# EAGLE design Carloop2-v3.2 (EAGLE 9.1.0)
DATABASE: /home/monkbroc/Electronics/eagle/PARTSDB.tsv
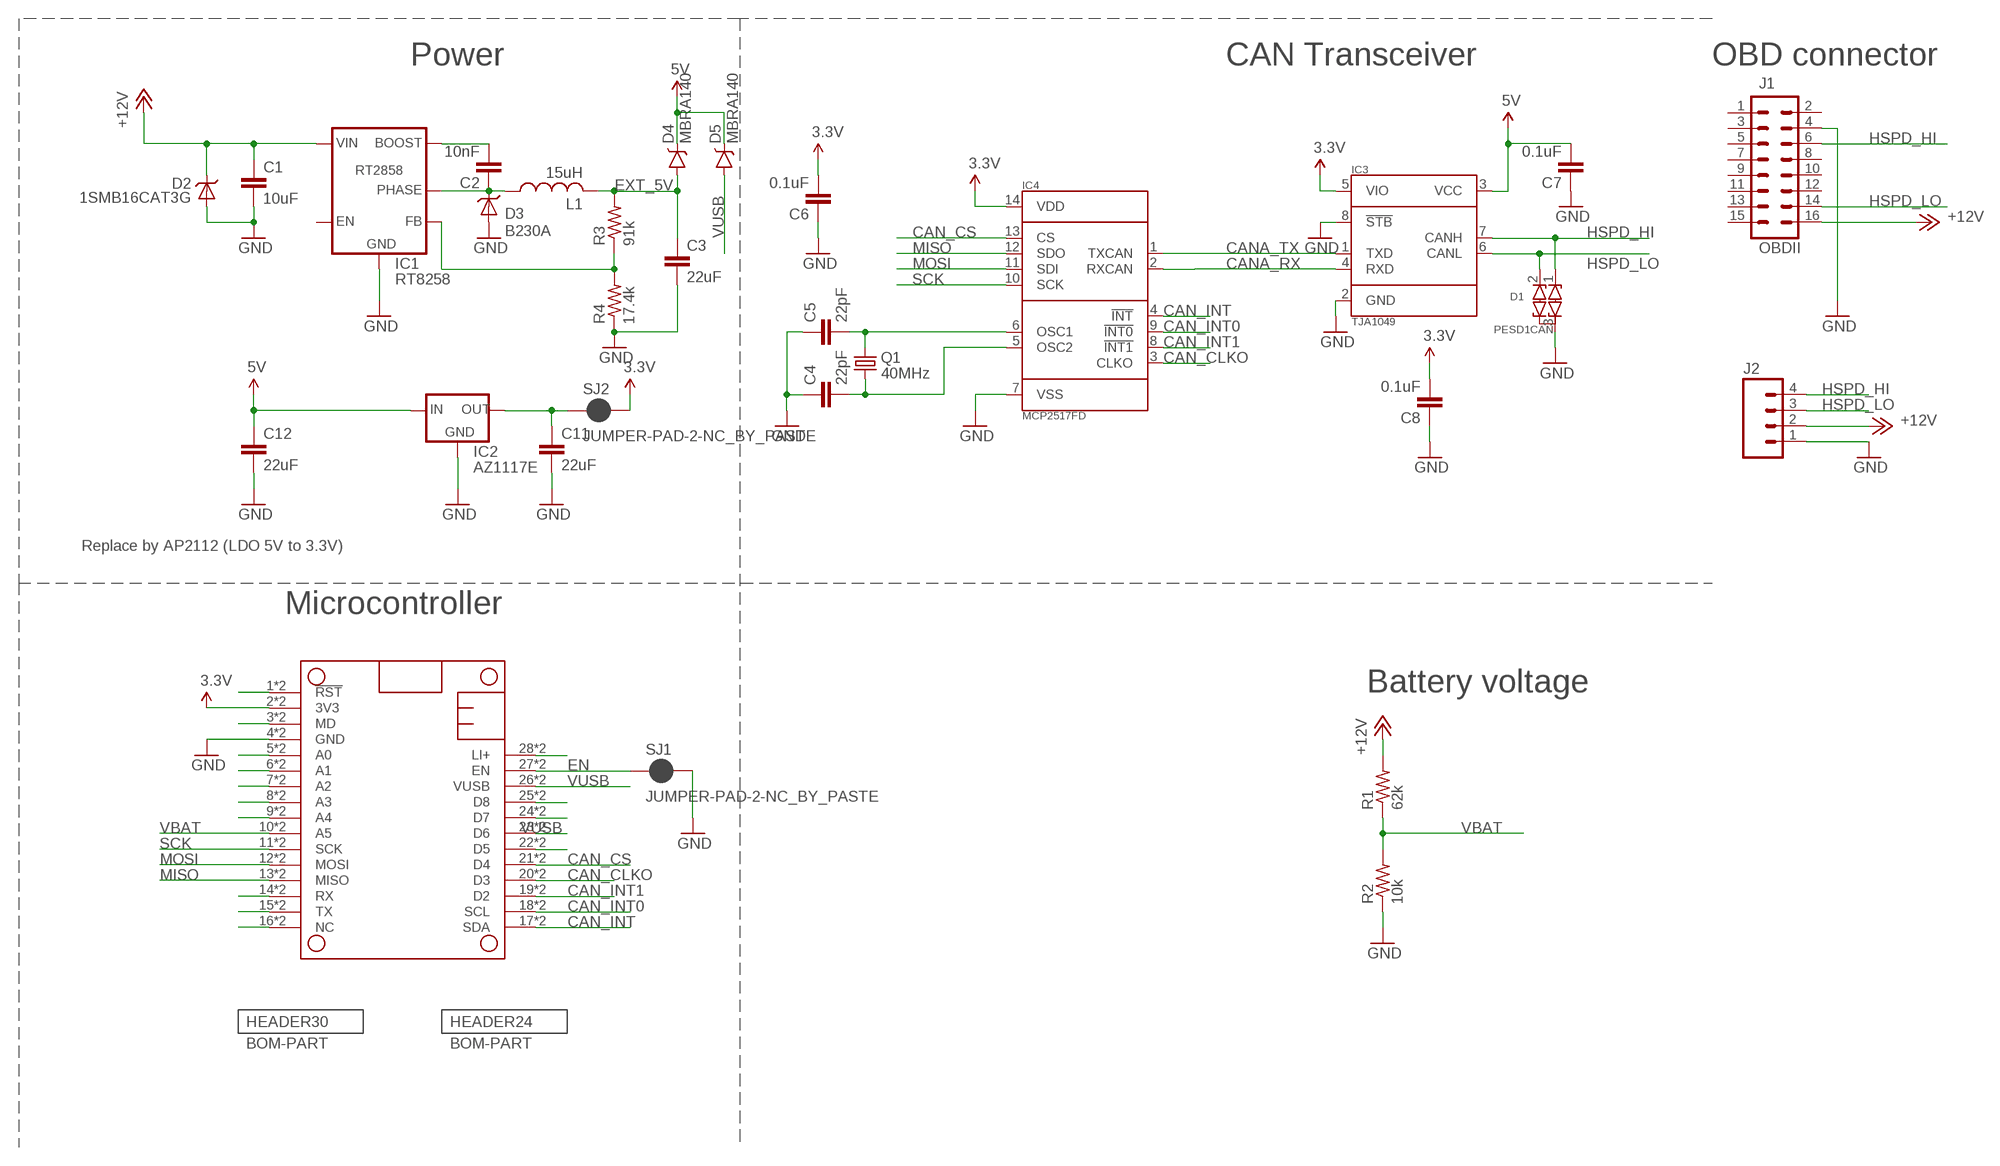
[diagram p0: schematic, sheet 1]
HEADER24 (BOM-PART): BOM: INCLUDE; PARTNO: NPPC122KFMS-RC; QTY: 1
HEADER30 (BOM-PART): BOM: INCLUDE; PARTNO: NPTC152KFMS-RC; QTY: 1

## Parts
C1  10uF  C-EUC1206  [C1206]
C2  10nF  C-EUC0603  [C0603]
C3  22uF  C-EUC1206  [C1206]
C4  22pF  C-EUC0603  [C0603]
C5  22pF  C-EUC0603  [C0603]
C6  0.1uF  C-EUC0603  [C0603]
C7  0.1uF  C-EUC0603  [C0603]
C8  0.1uF  C-EUC0603  [C0603]
C11  22uF  C-EUC1206  [C1206]
C12  22uF  C-EUC1206  [C1206]
D1  PESD1CAN  DIODE_ESD_DUAL-SOT-23  [SOT23]
D2  1SMB16CAT3G  DIODE-TVS-SMB  [SMB-DIODE]
D3  B230A  DIODE-SCHOTTKY  [DO-214AA]
D4  MBRA140  [SMA-DIODE]
D5  MBRA140  [SMA-DIODE]
IC1  RT8258  [SOT-23-6]
IC2  AZ1117E  [SOT223]
IC3  TJA1049  [SO8]
IC4  MCP2517FD  [SOIC-14]
IC5  PARTICLE_MESH_SMTDUAL  [FEATHERWING_SMT2]
J1  OBDII  M08X2-OBDII-COMTECH  [OBDII-COMTECH]
J2  M04SCREW  [SCREWTERMINAL-3.5MM-4]
L1  15uH  L-US  [NR8040]
Q1  40MHz  CRYSTAL5X3  [CRYSTAL-SMD-5X3]
R1  62k  R-US_R0603  [R0603]
R2  10k  R-US_R0603  [R0603]
R3  91k  R-US_R0603  [R0603]
R4  17.4k  R-US_R0603  [R0603]
SJ1  JUMPER-PAD-2-NC_BY_PASTE  [PAD-JUMPER-2-NC_BY_PASTE_YES_SILK]
SJ2  JUMPER-PAD-2-NC_BY_PASTE  [PAD-JUMPER-2-NC_BY_PASTE_YES_SILK]

## Nets
3.3V: C6.2 C8.2 IC3.5(VIO) IC4.14(VDD) IC5.2'(3V3) IC5.2(3V3) SJ2.2
5V: C7.2 C12.1 D4.C D5.C IC2.3(IN) IC3.3(VCC)
+12V [power]: C1.1 D2.C IC1.5(VIN) J1.16 J2.2 R1.2
BOOST\: C2.2 IC1.1(BOOST)
CAN_CLKO: IC4.3(CLKO) IC5.20'(D3) IC5.20(D3)
CAN_CS: IC4.13(CS) IC5.21'(D4) IC5.21(D4)
CAN_INT: IC4.4(!INT) IC5.17'(SDA) IC5.17(SDA)
CAN_INT0: IC4.9(!INT0) IC5.18'(SCL) IC5.18(SCL)
CAN_INT1: IC4.8(!INT1) IC5.19'(D2) IC5.19(D2)
CANA_RX: IC3.4(RXD) IC4.2(RXCAN)
CANA_TX: IC3.1(TXD) IC4.1(TXCAN)
EN: IC5.27'(EN) IC5.27(EN) SJ1.1
EXT_5V: C3.1 D4.A L1.P$2 R3.2
FB: IC1.3(FB) R3.1 R4.2
GND [power]: C1.2 C3.2 C4.1 C5.1 C6.1 C7.1 C8.1 C11.2 C12.2 D1.3(COM) D2.A D3.+(A) IC1.2(GND) IC2.1(GND) IC2.4(GND) IC3.2(GND) IC3.8(!STB) IC4.7(VSS) IC5.4'(GND) IC5.4(GND) J1.4 J2.1 R2.1 R4.1 SJ1.2
HSPD_HI: D1.1(C1) IC3.7(CANH) J1.6 J2.4
HSPD_LO: D1.2(C2) IC3.6(CANL) J1.14 J2.3
LI+: IC5.28'(LI+) IC5.28(LI+)
MISO: IC4.12(SDO) IC5.13'(MISO) IC5.13(MISO)
MOSI: IC4.11(SDI) IC5.12'(MOSI) IC5.12(MOSI)
N$1: C11.1 IC2.2(OUT) SJ2.1
N$2: C5.2 IC4.6(OSC1) Q1.3
N$3: IC5.1'(!RST) IC5.1(!RST)
N$4: IC5.3'(MD) IC5.3(MD)
N$5: IC5.5'(A0) IC5.5(A0)
N$6: IC5.6'(A1) IC5.6(A1)
N$7: IC5.7'(A2) IC5.7(A2)
N$8: IC5.8'(A3) IC5.8(A3)
N$9: IC5.9'(A4) IC5.9(A4)
N$10: IC5.25'(D8) IC5.25(D8)
N$11: IC5.24'(D7) IC5.24(D7)
N$12: IC5.23'(D6) IC5.23(D6)
N$13: IC5.22'(D5) IC5.22(D5)
N$14: IC5.14'(RX) IC5.14(RX)
N$15: IC5.15'(TX) IC5.15(TX)
N$16: IC5.16'(NC) IC5.16(NC)
N$18: C4.2 IC4.5(OSC2) Q1.1
PHASE: C2.1 D3.-(C) IC1.6(PHASE) L1.P$1
SCK: IC4.10(SCK) IC5.11'(SCK) IC5.11(SCK)
VBAT: IC5.10'(A5) IC5.10(A5) R1.1 R2.2
VUSB: D5.A IC5.26'(VUSB) IC5.26(VUSB)
Unconnected: IC1.4(EN) J1.1 J1.2 J1.3 J1.5 J1.7 J1.8 J1.9 J1.10 J1.11 J1.12 J1.13 J1.15

## Notes on the sheet
- Power | CAN Transceiver | OBD connector
- Replace by AP2112 (LDO 5V to 3.3V)
- Microcontroller
- Battery voltage

## Library data of the parts
C1 = rcl:C-EU: CAPACITOR, European symbol; PARTNO: C3216X7R1E106K160AB; SPICEPREFIX: C
C2 = rcl:C-EU: CAPACITOR, European symbol; PARTNO: CGA3E2X8R1H103K080AA; SPICEPREFIX: C
C3 C11 C12 = rcl:C-EU: CAPACITOR, European symbol; PARTNO: CL31X226KAHN3NE; SPICEPREFIX: C
C4 C5 = rcl:C-EU: CAPACITOR, European symbol; PARTNO: CC0603KRX7R9BB223; SPICEPREFIX: C
C6-C8 = rcl:C-EU: CAPACITOR, European symbol; PARTNO: CC0603JRX7R7BB104; SPICEPREFIX: C
D1 = MuniRent:DIODE_ESD_DUAL: Dual ESD Diode, with a common anode; PARTNO: PESD1CAN-215
D2 = BUG:DIODE-TVS; PARTNO: 1SMB16CAT3G; ROLE: Overvoltage protection
D3 = MuniRent:DIODE-SCHOTTKY; PARTNO: B230A-13-F
D4 D5 = SparkFun-DiscreteSemi:MBRA140: 40V, 1A Schottky rectifier SMA/DO-214AC package DIO-08053; PARTNO: MBRA140T3G; PROD_ID: DIO-08053
IC1 = MuniRent:RT8258; PARTNO: RT8258GJ6
IC2 = Carloop:AZ1117E: AZ1117E (https://www.diodes.com/assets/Datasheets/AZ1117E.pdf) - 1.3A output LDO Regulator; PARTNO: AZ1117EH-3.3TRG1
IC3 = MuniRent:TJA1049; PARTNO: TJA1049T-118
IC4 = Carloop:MCP2517FD; PARTNO: MCP2517FD-H/SL
IC5 = Particle-Mesh:PARTICLE_MESH; BOM: EXCLUDE
J1 = MuniRent:M08X2: .1" headers, two rows of 8 each; PARTNO: OBD-II
J2 = SparkFun-Connectors:M04: Header 4 Standard 4-pin 0.1" header. Use with straight break away headers (SKU : PRT-00116), right angle break away headers (PRT-00553), swiss pins (PRT-00743), machine pins (PRT-00117), and female headers (PRT-00115). Molex polarized connector foot print use with SKU : PRT-08231 with associated crimp pins and housings. 1MM SMD Version SKU: PRT-10208; PARTNO: OSTTE040104
L1 = MuniRent:L-US; PARTNO: NR8040T150M
Q1 = SparkFun-FreqCtrl:CRYSTAL: Various standard crystals. Proven footprints.; PARTNO: ECS-400-12-30B-AGM-TR; PROD_ID: XTAL-08218
R1 = rcl:R-US_: RESISTOR, American symbol; PARTNO: ERA-3AEB623V; SPICEPREFIX: R
R2 = rcl:R-US_: RESISTOR, American symbol; PARTNO: ERA-3AED103V; SPICEPREFIX: R
R3 = rcl:R-US_: RESISTOR, American symbol; PARTNO: ERA-3ARB913V; SPICEPREFIX: R
R4 = rcl:R-US_: RESISTOR, American symbol; PARTNO: ERJ-3EKF1742V; SPICEPREFIX: R
SJ1 SJ2 = SparkFun-Passives:JUMPER-PAD-2-NC_BY_PASTE; BOM: EXCLUDE

## Net classes
0 default: width 0.254 mm
1 power: width 0.508 mm, clearance 0.254 mm
2 thickpower: width 0.406 mm

## Board
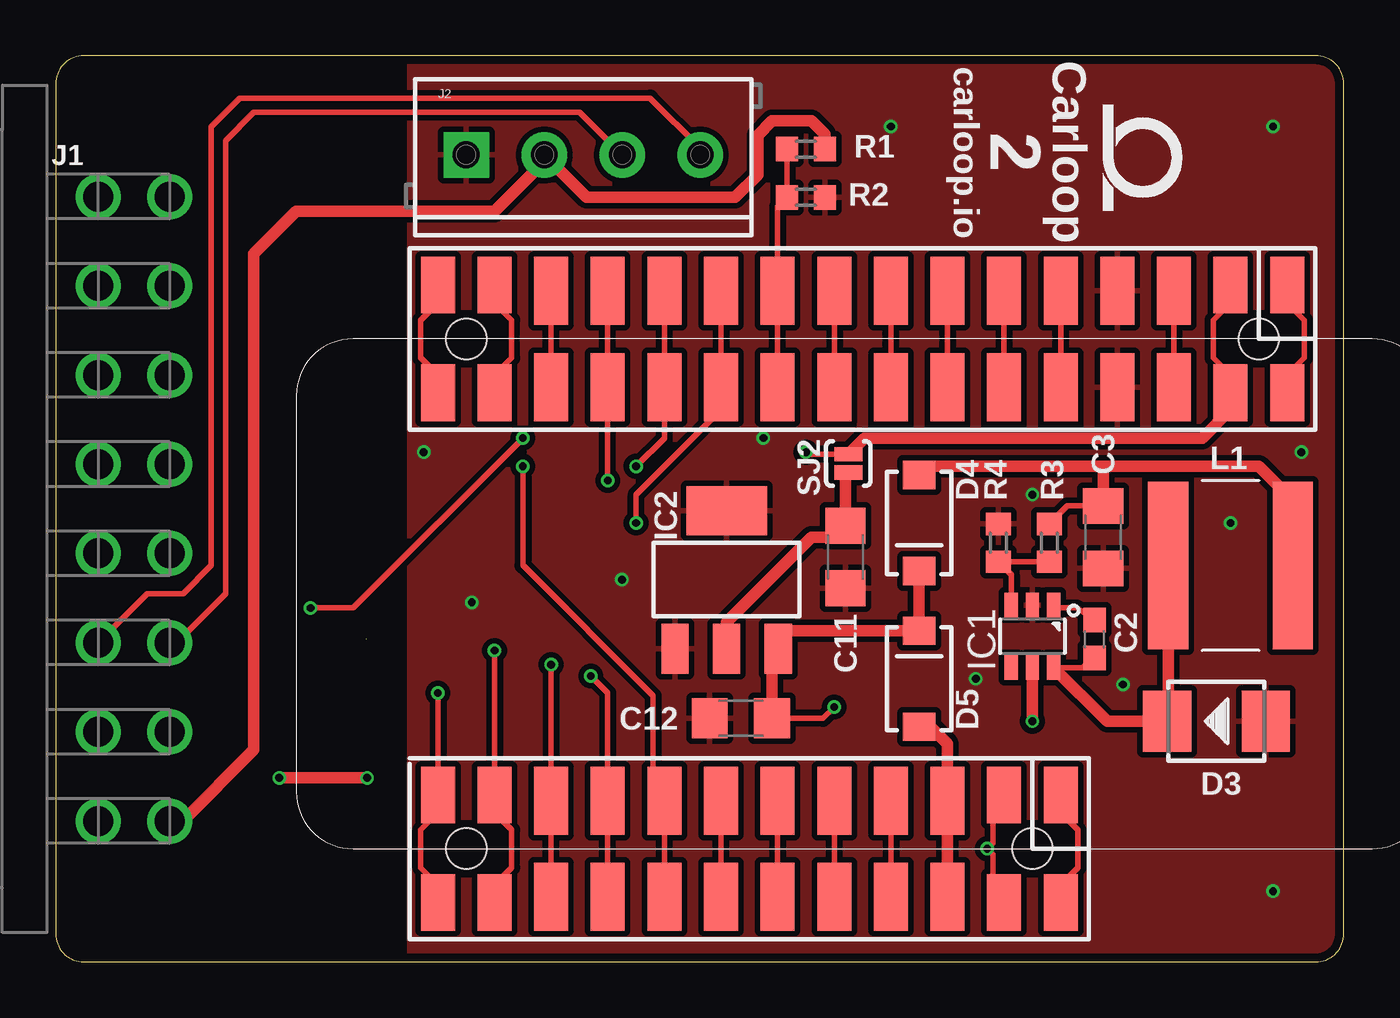
[diagram p1: board, top side]
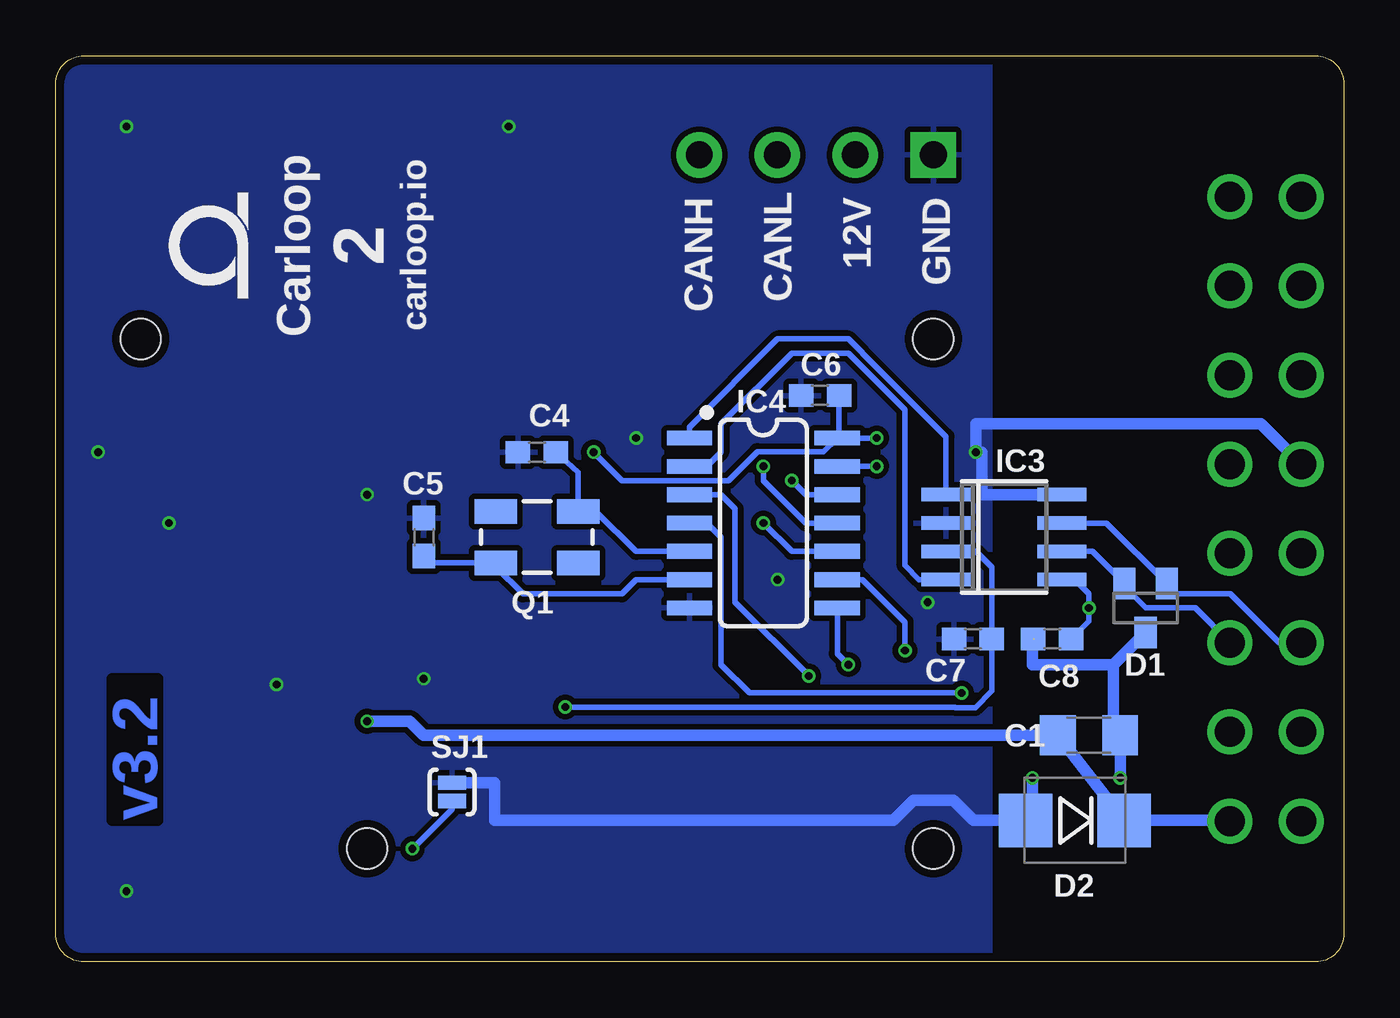
[diagram p2: board, bottom side, seen from below]

Size 57.79 x 40.64 mm. Coordinates in mm from the lower left corner, seen from the top.
Outline: 0,39.37 0,1.27 arc90 1.27,0 56.52,0 arc90 57.79,1.27 57.79,39.37 arc90 56.52,40.64 1.27,40.64 arc90 0,39.37
Copper layers (1*16): Top 0.035559375mm / dielectric 1.6mm / Bottom 0.035559375mm
Design rules "oshpark-2layer": minimum track width 6mil, minimum drill 10mil, track to track 6mil, track to pad 6mil, pad to pad 6mil, via to via 6mil, smd to smd 6mil, copper to edge 15mil, drill to drill 6mil, minimum pad ring 5mil, minimum via ring 5mil, stop-mask expansion 2.5mil, vias tented up to drill 0mil, thermal gap 10mil

### Footprints (pad centres in the part's own frame; a part is rotated, then mirrored left to right if it is on the bottom)
C1206 = smd 1.6 x 1.8: 1 -1.4,0; 2 1.4,0
C0603 = smd 1.1 x 1: 1 -0.85,0; 2 0.85,0
SOT23 = smd 1 x 1.4: 1 -0.95,-1.1; 2 0.95,-1.1; 3 0,1.1
SMB-DIODE = smd 2.4 x 2.4: A 2.2,0; C -2.2,0
DO-214AA = smd 2.159 x 2.743: + -2.21,0; - 2.21,0
SMA-DIODE = smd 1.27 x 1.47: A -2.15,0; C 2.15,0
SOT-23-6 = smd 1.1 x 0.6: 1 -1.4,0.95; 2 -1.4,0; 3 -1.4,-0.95; 4 1.4,-0.95; 5 1.4,0; 6 1.4,0.95
SOT223 = smd 1.219 x 2.235: 1 -2.311,-3.099; 2 0,-3.099; 3 2.311,-3.099 | smd 3.6 x 2.2: 4 0,3.099
SO8 = smd 0.6 x 2.2: 1 -1.905,-2.6; 2 -0.635,-2.6; 3 0.635,-2.6; 4 1.905,-2.6; 5 1.905,2.6; 6 0.635,2.6; 7 -0.635,2.6; 8 -1.905,2.6
SOIC-14 = smd 0.66 x 2.032: 1 -4.445,-3.315; 2 -3.175,-3.315; 3 -1.905,-3.315; 4 -0.635,-3.315; 5 0.635,-3.315; 6 1.905,-3.315; 7 3.175,-3.315; 8 3.175,3.315; 9 1.905,3.315; 10 0.635,3.315; 11 -0.635,3.315; 12 -1.905,3.315; 13 -3.175,3.315; 14 -4.445,3.315
FEATHERWING_SMT2 = smd 1.524 x 2.54: 1 6.35,2.413; 1' 6.35,-2.413; 2 8.89,2.413; 2' 8.89,-2.413; 15 41.91,2.413; 15' 41.91,-2.413; 16 44.45,2.413; 16' 44.45,-2.413; 17 44.45,20.447; 17' 44.45,25.273; 18 41.91,20.447; 18' 41.91,25.273; 27 19.05,20.447; 27' 19.05,25.273; 28 16.51,20.447; 28' 16.51,25.273 | smd 1.524 x 3.048: 3 11.43,2.159; 3' 11.43,-2.159; 4 13.97,2.159; 4' 13.97,-2.159; 5 16.51,2.159; 5' 16.51,-2.159; 6 19.05,2.159; 6' 19.05,-2.159; 7 21.59,2.159; 7' 21.59,-2.159; 8 24.13,2.159; 8' 24.13,-2.159; 9 26.67,2.159; 9' 26.67,-2.159; 10 29.21,2.159; 10' 29.21,-2.159; 11 31.75,2.159; 11' 31.75,-2.159; 12 34.29,2.159; 12' 34.29,-2.159; 13 36.83,2.159; 13' 36.83,-2.159; 14 39.37,2.159; 14' 39.37,-2.159; 19 39.37,20.701; 19' 39.37,25.019; 20 36.83,20.701; 20' 36.83,25.019; 21 34.29,20.701; 21' 34.29,25.019; 22 31.75,20.701; 22' 31.75,25.019; 23 29.21,20.701; 23' 29.21,25.019; 24 26.67,20.701; 24' 26.67,25.019; 25 24.13,20.701; 25' 24.13,25.019; 26 21.59,20.701; 26' 21.59,25.019 | hole 1.8: 17.78,22.86; 43.18,22.86; 7.62,0; 43.18,0
OBDII-COMTECH = drill 1.346: 1 -14,0; 2 -10,0; 3 -6,0; 4 -2,0; 5 2,0; 6 6,0; 7 10,0; 8 14,0; 9 -14,3.2; 10 -10,3.2; 11 -6,3.2; 12 -2,3.2; 13 2,3.2; 14 6,3.2; 15 10,3.2; 16 14,3.2
SCREWTERMINAL-3.5MM-4 = drill 1.2 pad 2.032 square: 1 0,0 | drill 1.2 pad 2.032: 2 3.5,0; 3 7,0; 4 10.5,0
NR8040 = smd 1.8 x 7.5: P$1 2.8,0; P$2 -2.8,0
CRYSTAL-SMD-5X3 = smd 1.9 x 1.1: 1 -1.85,-1.15; 2 1.85,-1.15; 3 1.85,1.15; 4 -1.85,1.15
R0603 = smd 1 x 1.1: 1 -0.85,0; 2 0.85,0
PAD-JUMPER-2-NC_BY_PASTE_YES_SILK = smd 0.635 x 1.27: 1 -0.401,0; 2 0.413,0

### Placement (x,y rotation side)
C1  11.43,10.16 0 bottom
C2  46.61,14.48 90 top
C3  46.99,19.05 270 top
C4  36.2,22.86 0 bottom
C5  41.27,19.05 270 bottom
C6  23.49,25.4 0 bottom
C7  16.64,14.48 0 bottom
C8  13.08,14.48 0 bottom
C11  35.43,18.16 270 top
C12  30.73,10.92 180 top
D1  8.89,15.88 180 bottom
D2  12.06,6.35 180 bottom
D3  52.07,10.8 180 top
D4  38.73,19.69 270 top
D5  38.73,12.7 90 top
IC1  43.82,14.61 270 top
IC2  30.1,17.14 0 top
IC3  15.24,19.05 270 bottom
IC4  26.04,19.05 270 bottom
IC5  61.59,27.94 180 top
J1  1.91,20.32 270 top
J2  18.41,36.2 0 top
L1  52.71,17.78 180 top
Q1  36.2,19.05 180 bottom
R1  33.66,36.45 0 top
R2  33.66,34.29 180 top
R3  44.58,18.8 90 top
R4  42.29,18.8 270 top
SJ1  40.01,7.62 90 bottom
SJ2  35.56,22.35 90 top
U$3  LOGOSMALL  [CARLOOP-2]  48.77,36.07 270 top
U$5  LOGOSMALL  [CARLOOP-2]  50.93,32.13 90 bottom

### Tracks (layer width: path | path; a pad name or v marks a point on that pad's centre or on a via)
3.3V  (via drill 0.35)
  Top 0.254: IC5.2 52.71,26.32 51.93,27.09 51.93,28.79 52.71,29.56 IC5.2' | SJ2.2 33.75,22.77 v33.66,22.86 | v20.95,23.5 13.34,15.88 v11.43,15.88
  Top 0.508: IC5.2 52.71,24.77 51.44,23.5 36.29,23.5 SJ2.2
  Bottom 0.254: IC3.5 12.69,17.1 12.02,17.1 11.43,16.51 v11.43,15.88 11.43,15.28 C8.2 | C6.2 22.64,23.57 IC4.14 | IC4.14 23.33,22.88 26.31,22.88 27.6,21.59 32.39,21.59 v33.66,22.86 | IC4.14 v20.95,23.5
5V  (via drill 0.35)
  Top 0.254: C12.1 34.42,10.92 v34.93,11.43
  Top 0.508: D4.C D5.C 32.41,14.85 IC2.3 32.13,13.77 C12.1
  Bottom 0.254: IC3.3 16.51,18.41 15.79,17.69 C7.2 15.79,12.15 16.53,11.41 17.42,11.41 17.44,11.43 v34.93,11.43
+12V  (via drill 0.35)
  Top 0.508: IC1.5 v43.82,10.8 | J1.16 5.69,6.32 8.89,9.52 8.89,31.75 10.79,33.66 19.68,33.66 21.91,35.88 J2.2 23.82,34.29 30.48,34.29 31.5,35.31 31.5,37.08 32.13,37.72 33.91,37.72 34.51,37.12 R1.2
  Bottom 0.508: J1.16 arc-45 5.18,6.35 D2.C C1.1 41.27,10.16 41.91,10.8 v43.82,10.8
  Bottom 0.813: J1.16 arc-45 5.18,6.35
BOOST\
  Top 0.254: IC1.1 44.9,15.88 45.8,15.88 C2.2
CAN_CLKO  (via drill 0.35)
  Top 0.254: IC5.20' 24.76,6.99 | 24.76,6.99 IC5.20 | 24.76,6.99 24.76,12.07 v24,12.83
  Bottom 0.254: IC4.3 27.94,20.96 27.3,20.32 27.3,16.13 v24,12.83
CAN_CS  (via drill 0.35)
  Top 0.254: IC5.21' IC5.21 26.8,7.75 26.8,11.94 20.95,17.78 v20.95,22.23
  Bottom 0.254: IC4.13 v20.95,22.23
CAN_INT  (via drill 0.35)
  Top 0.254: IC5.17' 17.14,3.46 16.37,4.23 16.37,5.93 17.14,6.7 17.14,6.99 | 17.14,6.99 IC5.17 | v17.14,12.07 17.14,6.99
  Bottom 0.254: IC4.4 28.57,19.69 27.94,19.05 27.94,13.34 26.67,12.07 v17.14,12.07
CAN_INT0  (via drill 0.35)
  Top 0.254: IC5.18' 19.68,3.46 20.46,4.23 20.46,5.93 19.68,6.7 IC5.18 v19.68,13.97
  Bottom 0.254: IC4.9 21.59,17.14 19.68,15.24 v19.68,13.97
CAN_INT1  (via drill 0.35)
  Top 0.254: IC5.19' IC5.19 v22.22,13.34
  Bottom 0.254: IC4.8 22.72,13.83 v22.22,13.34
CANA_RX
  Bottom 0.254: IC4.2 28.57,22.23 27.94,22.86 27.94,24.13 24.76,27.3 22.22,27.3 19.68,24.77 19.68,17.78 19.05,17.14 IC3.4
CANA_TX
  Bottom 0.254: IC3.1 17.84,23.55 20.95,26.67 | 20.95,26.67 | 20.95,26.67 22.22,27.94 25.4,27.94 29.35,23.99 IC4.1
EN  (via drill 0.35)
  Top 0.254: 42.29,2.67 IC5.27' 42.04,3.17 42.04,4.83 v41.78,5.08 42.04,5.33 42.04,6.99 IC5.27
  Bottom 0.254: v41.78,5.08 40.01,6.86 SJ1.1
EXT_5V
  Top 0.254: R3.2 45.38,20.45 C3.1
  Top 0.508: L1.P$2 55.25,18.04 55.25,20.96 53.98,22.23 46.99,22.23 | 46.99,22.23 38.73,22.23 D4.A | C3.1 46.99,22.23
FB
  Top 0.254: R3.1 R4.2 42.87,17.37 IC1.3
GND  (via drill 0.35)  (1 unrouted)
  Top 0.508: v13.97,8.25 v10.03,8.25
  Bottom 0.508: J1.4 3.71,24.13 16.51,24.13 v16.51,22.86 16.23,22.86 16.23,20.96 IC3.8 | D1.3 10.33,13.34 | C8.1 13.97,14.49 13.97,13.34 10.33,13.34 | v13.97,8.25 13.97,6.65 D2.A 16.62,6.35 17.52,7.25 19.31,7.25 20.21,6.35 38.1,6.35 38.1,8.03 SJ1.2 | v10.03,8.25 C1.2 10.33,10.16 10.33,13.34
  other vias: 37.47,37.47 54.61,37.47 52.71,19.69 55.88,22.86 41.27,12.7 25.4,17.14 18.67,16.13 31.75,23.5 43.82,20.96 47.88,12.45 54.61,3.17
  pour Bottom: 15.88,40.64 15.88,0 57.79,0 57.79,40.64
  pour Top: 15.88,40.64 15.88,0 57.79,0 57.79,40.64
HSPD_HI
  Top 0.254: J1.6 4.1,16.51 5.71,16.51 6.99,17.78 6.99,37.47 8.26,38.73 26.67,38.73 28.91,36.49 J2.4
  Bottom 0.254: J1.6 2.89,14.32 5.08,16.51 7.62,16.51 7.94,16.83 D1.1 10.65,19.69 IC3.7
HSPD_LO
  Top 0.254: J2.3 23.51,38.1 8.89,38.1 7.62,36.83 7.62,16.51 5.43,14.32 J1.14
  Bottom 0.254: J1.14 6.66,15.88 8.89,15.88 9.84,16.82 D1.2 11.28,18.41 IC3.6
LI+
  Top 0.254: IC5.28 45.09,6.7 45.86,5.93 45.86,4.23 45.09,3.46 IC5.28'
MISO  (via drill 0.35)
  Top 0.254: v24.76,21.59 IC5.13 IC5.13'
  Bottom 0.254: IC4.12 24.13,20.96 v24.76,21.59
MOSI  (via drill 0.35)
  Top 0.254: v26.04,22.23 27.3,23.5 IC5.12 IC5.12'
  Bottom 0.254: IC4.11 24.13,19.69 26.04,21.59 v26.04,22.23
N$1
  Top 0.508: IC2.2 30.1,15.24 33.91,19.05 34.92,19.05 C11.1 35.43,21.82 SJ2.1
N$2
  Bottom 0.254: IC4.6 31.75,17.14 32.39,16.51 36.83,16.51 38.05,17.73 Q1.3 41.08,17.9 C5.2
N$3
  Top 0.254: IC5.1' 55.25,29.56 56.02,28.79 56.02,27.09 55.25,26.32 IC5.1
N$4
  Top 0.254: IC5.3' IC5.3
N$5
  Top 0.254: IC5.5 IC5.5'
N$6
  Top 0.254: IC5.6' IC5.6
N$7
  Top 0.254: IC5.7' IC5.7
N$8
  Top 0.254: IC5.8 IC5.8'
N$9
  Top 0.254: IC5.9' IC5.9
N$10
  Top 0.254: IC5.25 IC5.25'
N$11
  Top 0.254: IC5.24' IC5.24
N$12
  Top 0.254: IC5.23 IC5.23'
N$13
  Top 0.254: IC5.22' IC5.22
N$14
  Top 0.254: IC5.14 IC5.14'
N$15
  Top 0.254: IC5.15 19.68,26.32 20.46,27.09 20.46,28.79 19.68,29.56 IC5.15'
N$16
  Top 0.254: IC5.16' 17.14,29.56 16.37,28.79 16.37,27.09 17.14,26.32 IC5.16
N$18
  Bottom 0.254: C4.2 34.34,21.96 Q1.1 33.54,20.2 31.75,18.41 IC4.5
PHASE
  Top 0.254: IC1.6 46.03,13.2 C2.1
  Top 0.508: L1.P$1 49.91,10.84 D3.- 47.18,10.8 IC1.6
SCK  (via drill 0.35)
  Top 0.254: v26.04,19.69 26.04,20.96 27.3,22.23 29.84,24.77 29.84,25.4 | 29.84,25.4 IC5.11 | IC5.11' 29.84,25.4
  Bottom 0.254: IC4.10 24.76,18.41 v26.04,19.69
VBAT
  Top 0.254: R1.1 R2.2 32.39,33.87 IC5.10' IC5.10
VUSB
  Top 0.508: D5.A 39.23,10.55 39.97,9.82 40.01,9.77 IC5.26 40.01,2.77 IC5.26'

### Text on the board
Bottom: v3.2
tPlace: carloop.io | 2 | Carloop
bPlace: GND | 12V | CANL | CANH | carloop.io | 2 | Carloop